# EasyEDA Pro project 分电板.epro

# Schematic Schematic4
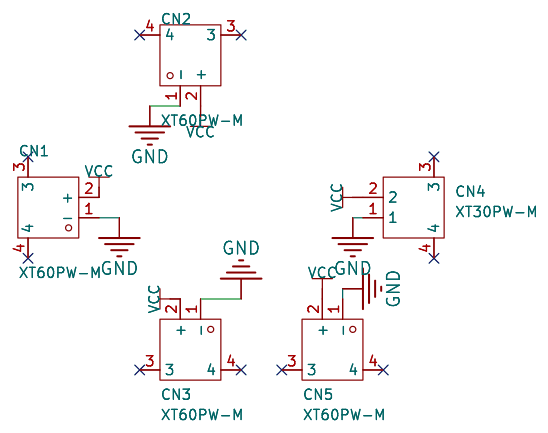
[diagram p0: schematic sheet]

## Parts
CN1  XT60PW-M  [CONN-TH_XT60PW-M]
CN2  XT60PW-M  [CONN-TH_XT60PW-M]
CN3  XT60PW-M  [CONN-TH_XT60PW-M]
CN4  XT30PW-M  [CONN-TH_XT30PW-M]
CN5  XT60PW-M  [CONN-TH_XT60PW-M]

## Library data of the parts
CN1-CN3 CN5 = XT60PW-M: 类别:-;类型1:-;; LCSC Part Name: AMASS(艾迈斯)航模插头xt60连接器150公母对接pw锂电池公头 板插卧式XT60PW-M; Supplier Part: C98732; Manufacturer: AMASS(艾迈斯); JLCPCB Part Class: 扩展库; Datasheet: https://atta.szlcsc.com/upload/public/pdf/source/20190916/C428722_DFF78979486FCB0B58C1FC563067EC88.pdf; Supplier: LCSC; Brand: 艾迈斯; Type: 卧式插头; Colour: 黄色; InterfaceType: 公头
CN4 = XT30PW-M: 类别:-;类型1:-;; LCSC Part Name: AMASS(艾迈斯)航模插头 卧式弯脚 XT30PW-M公头; Supplier Part: C431092; Manufacturer: AMASS(艾迈斯); JLCPCB Part Class: 扩展库; Datasheet: https://atta.szlcsc.com/upload/public/pdf/source/20220222/6A9F22F7850E25B33E1BE430ADF8560B.pdf; Supplier: LCSC; Brand: 艾迈斯; Type: 航模插头; RatedVoltage: DC 500V; InterfaceType: 公头; RatedCurrent: 15A; RecommendedWireGauge: 16/18/20AWG; contact resistance: 1.2mΩ; specifications: 2pin

## Nets
GND: CN1.1(-) CN2.1(-) CN3.1(-) CN4.1 CN5.1(-)
VCC: CN1.2(+) CN2.2(+) CN3.2(+) CN4.2 CN5.2(+)

Not connected (* = marked no-connect by the designer): CN1 3* 4*; CN2 3* 4*; CN3 3* 4*; CN4 3* 4*; CN5 3* 4*

# Board PCB4
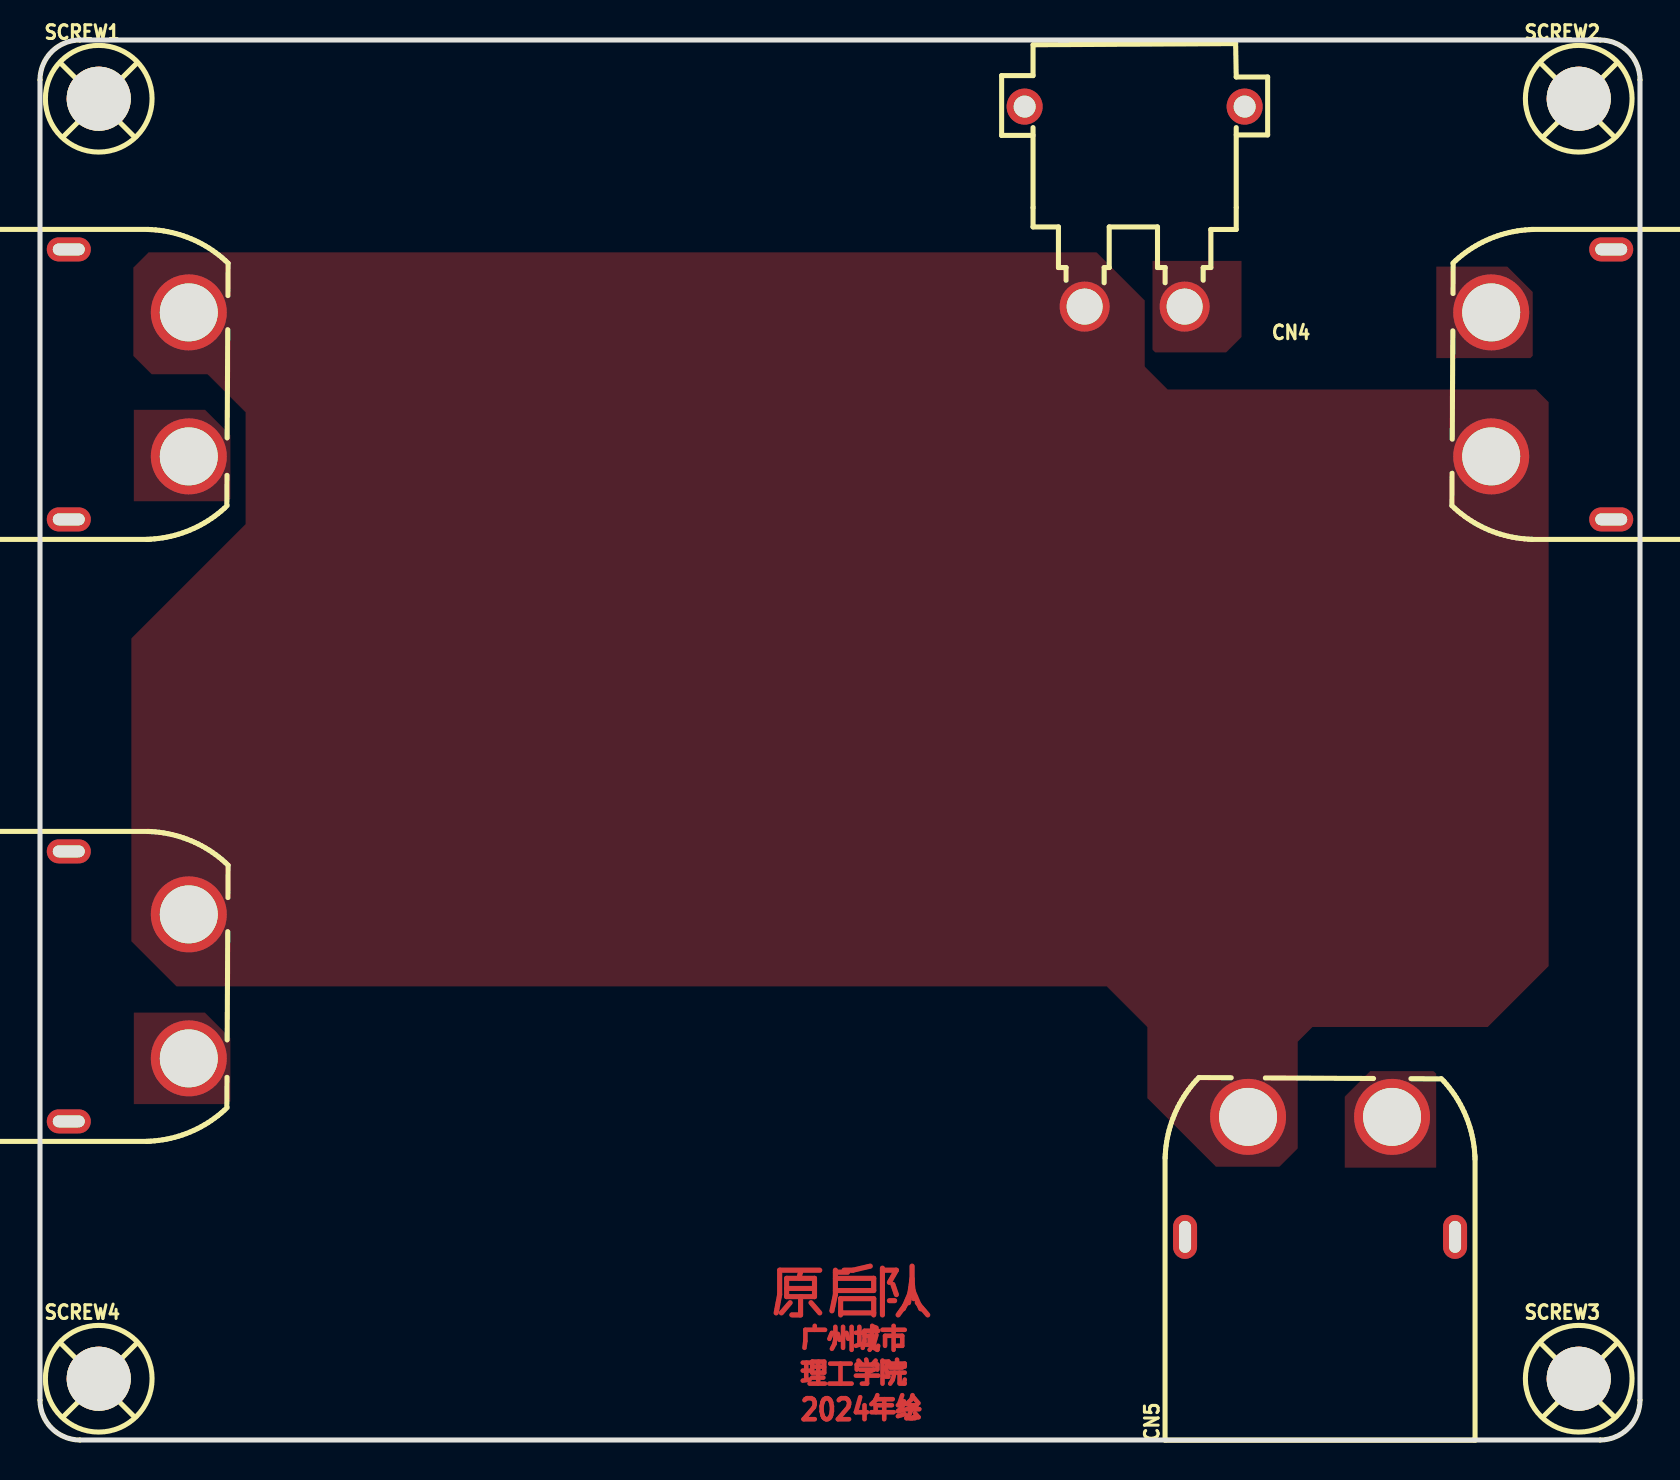
[diagram p1: board, top side]
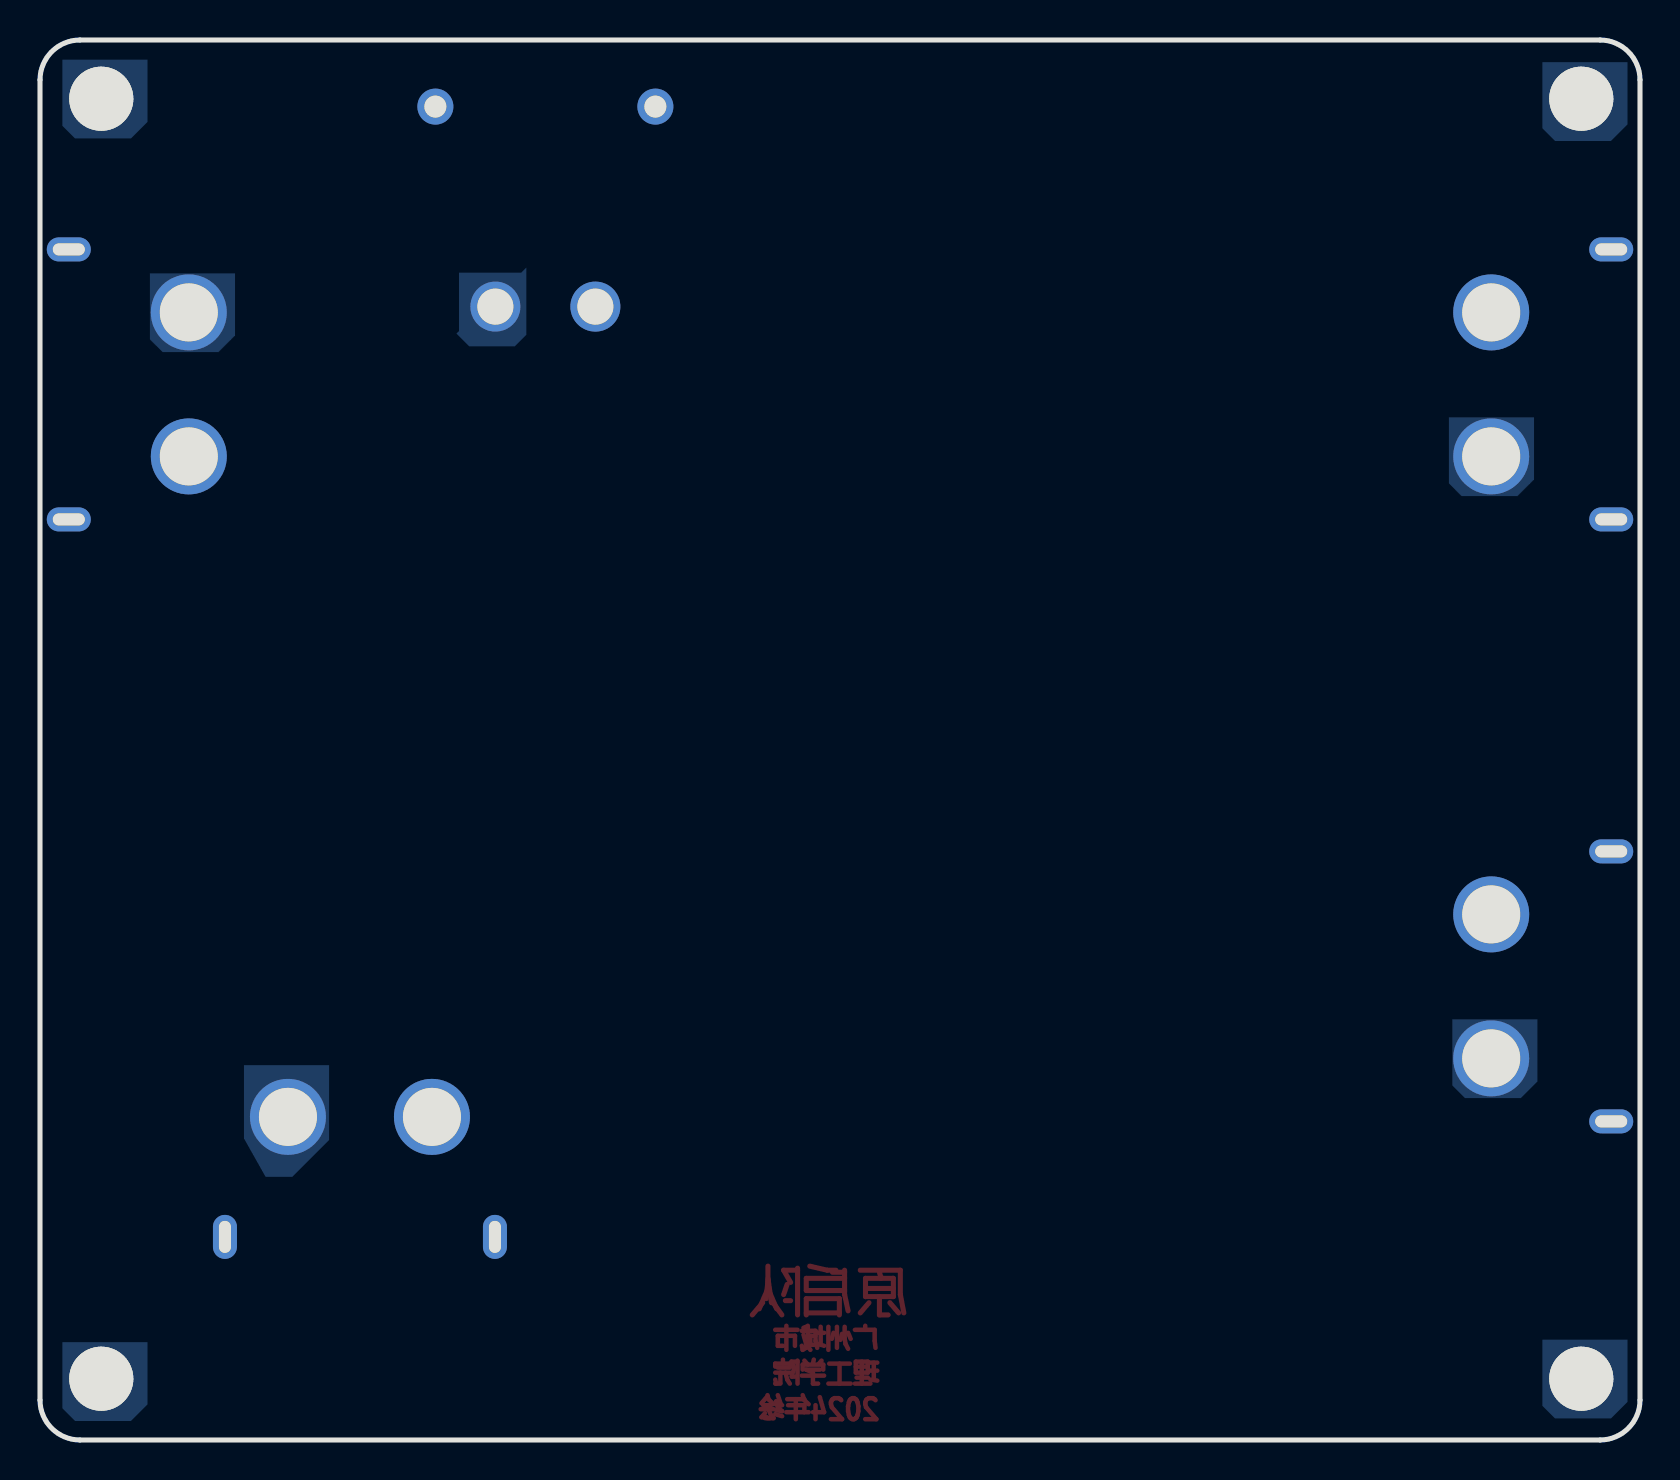
[diagram p2: board, bottom side, seen from below]

Outline 80 x 70 mm; copper layers: Top Layer, Bottom Layer. Coordinates in mm from the lower left corner of the outline.
Outline path: 0,68 0,2 arc(0.59,0.59) 2,0 78,0 arc(79.41,0.59) 80,2 80,68 arc(79.41,69.41) 78,70 2,70 arc(0.59,69.41) 0,68
Stack: Top Layer 0.035mm / Dielectric1 1.51mm FR4 er 4.5 / Bottom Layer 0.035mm

## Design rules (mm)
template: JLCPCB Capability(Two Layers Board)
spacing copperThickness1oz (default): track to track 0.102, other pairs 0.152 to 0.3
spacing copperThickness2oz: track to track 0.203, other pairs 0.152 to 0.3
track width copperThickness1oz (default): min 0.127, default 0.254, max 2.54
track width copperThickness2oz: min 0.203, default 0.254, max 2.54
differential pair differentialPair (default): width min 0.127, default 0.254, max 2.54; gap min 0.152, default 0.152
via viaSize (default): diameter min 0.5, default 0.61, max 10; hole min 0.3, default 0.305, max 6.3

## Placement (name value [footprint] x y rotation side)
CN1  XT60PW-M  [CONN-TH_XT60PW-M]  4.44 52.78 0 top
CN2  XT60PW-M  [CONN-TH_XT60PW-M]  4.44 22.68 0 top
CN3  XT60PW-M  [CONN-TH_XT60PW-M]  75.56 52.78 180 top
CN4  XT30PW-M  [CONN-TH_XT30PW-M]  54.73 61.67 180 top
CN5  XT60PW-M  [CONN-TH_XT60PW-M]  64 13.16 90 top
SCREW1  -  [M3螺丝]  3 67 0 top
SCREW2  -  [M3螺丝]  77 67 0 top
SCREW3  -  [M3螺丝]  77 3 0 top
SCREW4  -  [M3螺丝]  3 3 0 top

## Footprints (pads in the part's own frame, mm; a bottom-side part is the same pattern mirrored in y, then rotated)
CONN-TH_XT30PW-M
  round 2.5 hole 1.8: 1(-2.5,5) 2(2.5,5)
  round 1.8 hole 1.1: 3(5.5,-5) 4(-5.5,-5)
CONN-TH_XT60PW-M
  round 3.8 hole 2.9: 1(3,-3.6) 2(3,3.6)
  oval 2.2x1.2 hole 1.6x0.6: 3(-3,6.75) 4(-3,-6.75)
M3螺丝
  round 3.2 hole 3.2: 1(-0.064,0.064)

## Nets
GND: CN1.1 CN2.1 CN3.1 CN4.1 CN5.1 SCREW1.1 SCREW2.1 SCREW3.1 SCREW4.1
VCC: CN1.2 CN2.2 CN3.2 CN4.2 CN5.2

Pads without a net: CN1 3 4; CN2 3 4; CN3 3 4; CN4 3 4; CN5 3 4

## Copper pours and planes (outline as drawn; the poured copper is in the pictures)
GND on Top Layer: 55.63,58.96 60.07,58.96 60.07,54.38 55.63,54.38
GND on Top Layer: 65.24,18.44 69.81,18.44 69.81,13.62 65.24,13.62
GND on Top Layer: -34.93,98.25 118.49,98.25 118.49,-18.34 -34.93,-18.34
GND on Top Layer: 69.81,58.67 74.64,58.67 74.64,54.09 69.81,54.09
GND on Top Layer: 4.69,51.51 9.52,51.51 9.52,46.94 4.69,46.94
GND on Top Layer: 4.69,21.37 9.52,21.37 9.52,16.79 4.69,16.79
GND on Bottom Layer: 74.62,69.02 78.88,69.02 78.88,65.08 74.62,65.08
GND on Bottom Layer: 70.25,58.33 74.5,58.33 74.5,54.39 70.25,54.39
GND on Bottom Layer: 5.13,21.03 9.39,21.03 9.39,17.1 5.13,17.1
GND on Bottom Layer: 74.62,4.89 78.88,4.89 78.88,0.95 74.62,0.95
GND on Bottom Layer: 5.3,51.13 9.56,51.13 9.56,47.19 5.3,47.19
GND on Bottom Layer: 0.62,5.02 4.88,5.02 4.88,1.08 0.62,1.08
GND on Bottom Layer: 65.54,18.74 69.8,18.74 69.8,13.16 65.54,13.16
GND on Bottom Layer: -8.26,74.62 104.26,74.62 104.26,-11.23 -8.26,-11.23
GND on Bottom Layer: 55.68,58.62 59.18,58.62 59.18,54.69 55.68,54.69
GND on Bottom Layer: 0.62,68.89 4.88,68.89 4.88,64.95 0.62,64.95
VCC on Top Layer: 55.37,21.28 64.13,21.28 64.13,13.66 55.37,13.66
VCC on Top Layer: 4.57,59.38 75.43,59.38 75.43,20.65 4.57,20.65

## Text on the board
Top Layer: 广州城市 / 理工学院 | 2024年绘 | 原启队
